# Altium schematic sheet Power.SchDoc
size A
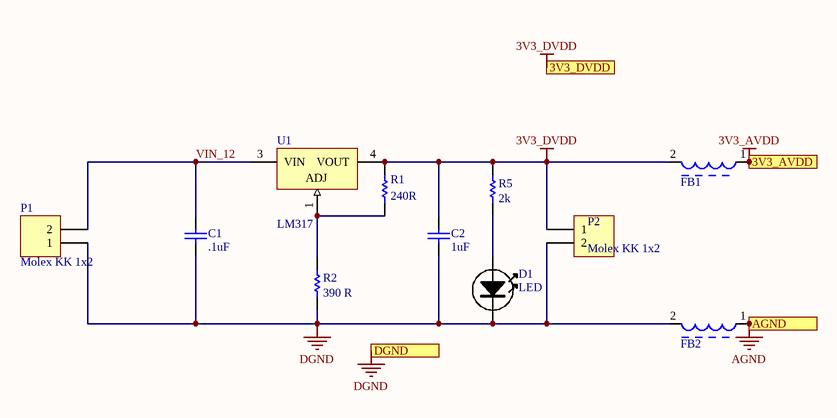
[diagram p0: Power.SchDoc]

## Parts
C1  .1uF  [C0805]
C2  1uF  [C0805]
D1  LED  [0805LED]
FB1  FERRITE  [R0805]  (value not drawn)
FB2  FERRITE  [R0805]  (value not drawn)
P1  Molex KK 1x2  [Molex KK 2x1]
P2  Molex KK 1x2  [Molex KK 2x1]
R1  240R  [R0805]
R2  390 R  [R0805]
R5  2k  [R0805]
U1  LM317  [D-PAK]

## Ports
3V3_AVDD, 3V3_DVDD, AGND, DGND

## Nets
3V3_AVDD: FB1.1 ; port 3V3_AVDD
3V3_DVDD: C2.1 FB1.2 P2.1 R1.2 R5.2 U1.4(VOUT) ; port 3V3_DVDD
AGND: FB2.1 ; port AGND
DGND: C1.2 C2.2 D1.K FB2.2 P1.1 P2.2 R2.1 ; port DGND
VIN_12: C1.1 P1.2 U1.3(VIN)
NetD1_A: D1.A R5.1
NetR1_1: R1.1 R2.2 U1.1(ADJ)

## Library data of the parts
C1 C2 = C0805: 0805 Capacitor
  C1: Value: .1uF
  C2: Value: 1uF
D1 = LED: Manufacturer: OSRAM Opto Semiconductors Inc; Manufacturer Part Number: LS T676-Q1R2-1-Z; Reel: D13
FB1 FB2 = FERRITE: FERRITE BEAD 0805
P1 P2 = Molex KK 1x2: 1x2 Molex KK Connector
R1 R2 R5 = R0805: RESISTOR 0805
  R1: Value: 240R
  R2: Value: 390 R
  R5: Value: 2k
U1 = LM317: Linear Voltage Regulator